# Altium schematic sheet Power.SchDoc
size A4
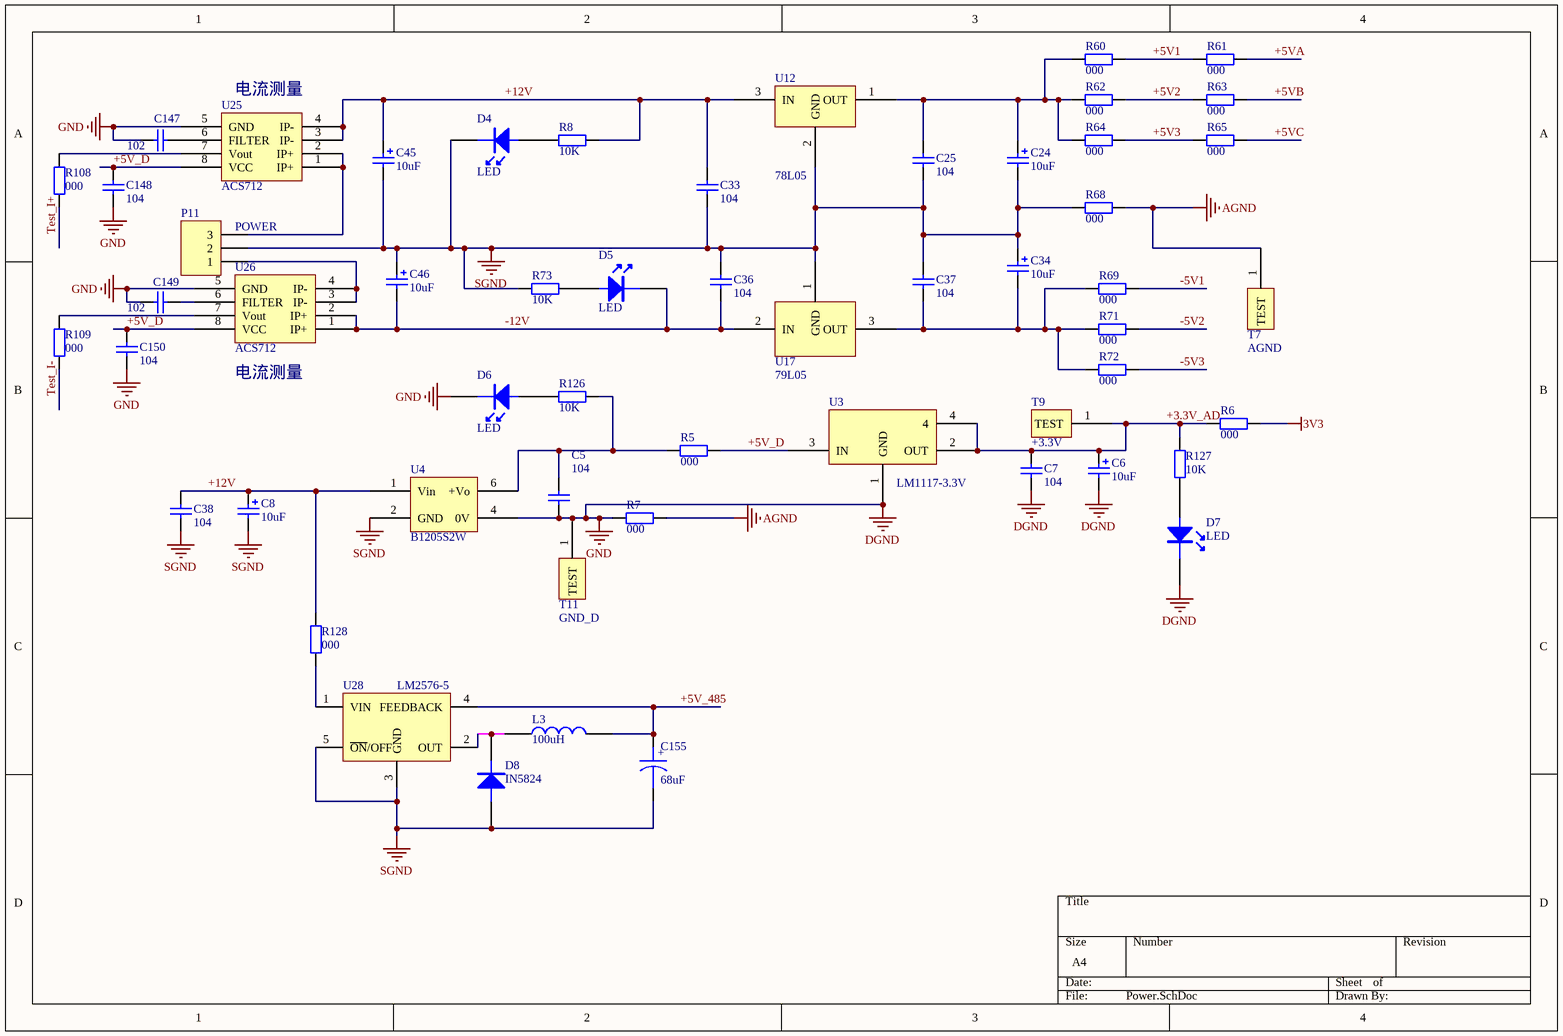
[diagram p0: Power.SchDoc]

## Parts
C5  104  [0805C]
C6  10uF  [C68uF]
C7  104  [0805C]
C8  10uF  [C68uF]
C24  10uF  [C68uF]
C25  104  [0805C]
C33  104  [0805C]
C34  10uF  [C68uF]
C36  104  [0805C]
C37  104  [0805C]
C38  104  [0805C]
C45  10uF  [C68uF]
C46  10uF  [C68uF]
C147  102  [0603]
C148  104  [0603]
C149  102  [0603]
C150  104  [0603]
C155  68uF  [C68uF]
D4  LED  [0805_LED]
D5  LED  [0805_LED]
D6  LED  [0805_LED]
D7  LED  [0805_LED]
D8  IN5824  [1N5824]
L3  100uH  [L100uH]
P11  POWER  [SIP3-5.08mm]
R5  000  [0805R]
R6  000  [0805R]
R7  000  [0805R]
R8  value 10K  [0603]  (hidden comment: Res2)
R60  000  [0805R]
R61  000  [0805R]
R62  000  [0805R]
R63  000  [0805R]
R64  000  [0805R]
R65  000  [0805R]
R68  000  [0805R]
R69  000  [0805R]
R71  000  [0805R]
R72  000  [0805R]
R73  value 10K  [0603]  (hidden comment: Res2)
R108  000  [0603]  (net tie, no BOM)
R109  000  [0603]  (net tie, no BOM)
R126  value 10K  [0603]  (hidden comment: Res2)
R127  value 10K  [0603]  (hidden comment: Res2)
R128  000  [0805R]
T7  AGND  [TEST]
T9  +3.3V  [TEST]
T11  GND_D  [TEST]
U3  LM1117-3.3V  [SOT223]
U4  B1205S2W  [B1205SW]
U12  78L05  [SOT89-M]
U17  79L05
U25  ACS712  [SO8]
U26  ACS712  [SO8]
U28  LM2576-5  [lm2596]

## Nets
3V3: R6.1
AGND: R7.1 R68.1 T7.1(TEST)
DGND: C5.2 C6.2 C7.2 C147.1 C148.2 C149.1 C150.2 D6.2(K) D7.2(K) R7.2 T11.1(TEST) U3.1(GND) U4.4(0V) U25.5(GND) U26.5(GND)  [also labelled GND]
SGND: C8.2 C24.2 C25.2 C33.2 C34.1 C36.1 C37.1 C38.2 C45.2 C46.1 C155.2 D4.2(K) D8.1(A) P11.2 R68.2 R73.2 U4.2(GND) U12.2(GND) U17.1(GND) U28.3(GND) U28.5(~{ON}/OFF)
+3.3V_AD: C6.1 C7.1 R6.2 R127.2 T9.1(TEST) U3.2(OUT) U3.4
+5V1: R60.1 R61.2
+5V2: R62.1 R63.2
+5V3: R64.1 R65.2
+5V_485: C155.1 L3.2 U28.4(FEEDBACK)
+5V_D: C148.1 C150.1 R5.1 U3.3(IN) U25.8(VCC) U26.8(VCC)
+5VA: R61.1
+5VB: R63.1
+5VC: R65.1
+12V: C8.1 C33.1 C38.1 C45.1 R8.2 R128.1 U4.1(Vin) U12.3(IN) U25.3(IP-) U25.4(IP-)
-5V1: R69.1
-5V2: R71.1
-5V3: R72.1
-12V: C36.2 C46.2 D5.2(K) U17.2(IN) U26.1(IP+) U26.2(IP+)
Test_I+: R108.1
Test_I-: R109.1
NetC5_1: C5.1 R5.2 R126.2 U4.6(+Vo)
NetC24_1: C24.1 C25.1 R60.2 R62.2 R64.2 U12.1(OUT)
NetC34_2: C34.2 C37.2 R69.2 R71.2 R72.2 U17.3(OUT)
NetC147_2: C147.2 U25.6(FILTER)
NetC149_2: C149.2 U26.6(FILTER)
NetD4_1: D4.1(A) R8.1
NetD5_1: D5.1(A) R73.1
NetD6_1: D6.1(A) R126.1
NetD7_1: D7.1(A) R127.1
NetD8_2: D8.2(K) L3.1 U28.2(OUT)
NetP11_1: P11.1 U26.3(IP-) U26.4(IP-)
NetP11_3: P11.3 U25.1(IP+) U25.2(IP+)
NetR108_2: R108.2 U25.7(Vout)
NetR109_2: R109.2 U26.7(Vout)
NetR128_2: R128.2 U28.1(VIN)

## Notes on the sheet
- (near U25) 电流测量
- (near U26) 电流测量
- (in symbol CAPACITOR POL) +

## Library data of the parts
C5 C7 C25 C33 C36-C38 C147-C150 = Cap: Capacitor; Value: 100nF; Published: 8-Jun-2000; LatestRevisionDate: 17-Jul-2002; LatestRevisionNote: Re-released for DXP Platform.; PackageReference: RAD-0.3; Publisher: Altium Limited
C6 C8 C24 C34 C45 C46 = Cap Pol2: Polarized Capacitor (Axial); Value: 100pF; Published: 8-Jun-2000; LatestRevisionDate: 17-Jul-2002; LatestRevisionNote: Re-released for DXP Platform.; PackageReference: POLAR0.8; Publisher: Altium Limited
C155 = CAPACITOR POL: Capacitor
D8 = DIODE
L3 = INDUCTOR
P11 = Header 3: Header, 3-Pin; LatestRevisionDate: 17-Jul-2002; LatestRevisionNote: Re-released for DXP Platform.; Publisher: Altium Limited
R5-R7 R60-R65 R68 R69 R71 R72 R108 R109 R128 = Res2: Resistor; Value: 1K; Published: 8-Jun-2000; LatestRevisionDate: 17-Jul-2002; LatestRevisionNote: Re-released for DXP Platform.; PackageReference: AXIAL-0.4; Publisher: Altium Limited
R8 R73 R126 R127 = Res2: Resistor; Published: 8-Jun-2000; LatestRevisionDate: 17-Jul-2002; LatestRevisionNote: Re-released for DXP Platform.; PackageReference: AXIAL-0.4; Publisher: Altium Limited
T7 T9 T11 = TEST
U28 = LM2596-5